# EAGLE design contact control board smd (EAGLE 6.4)
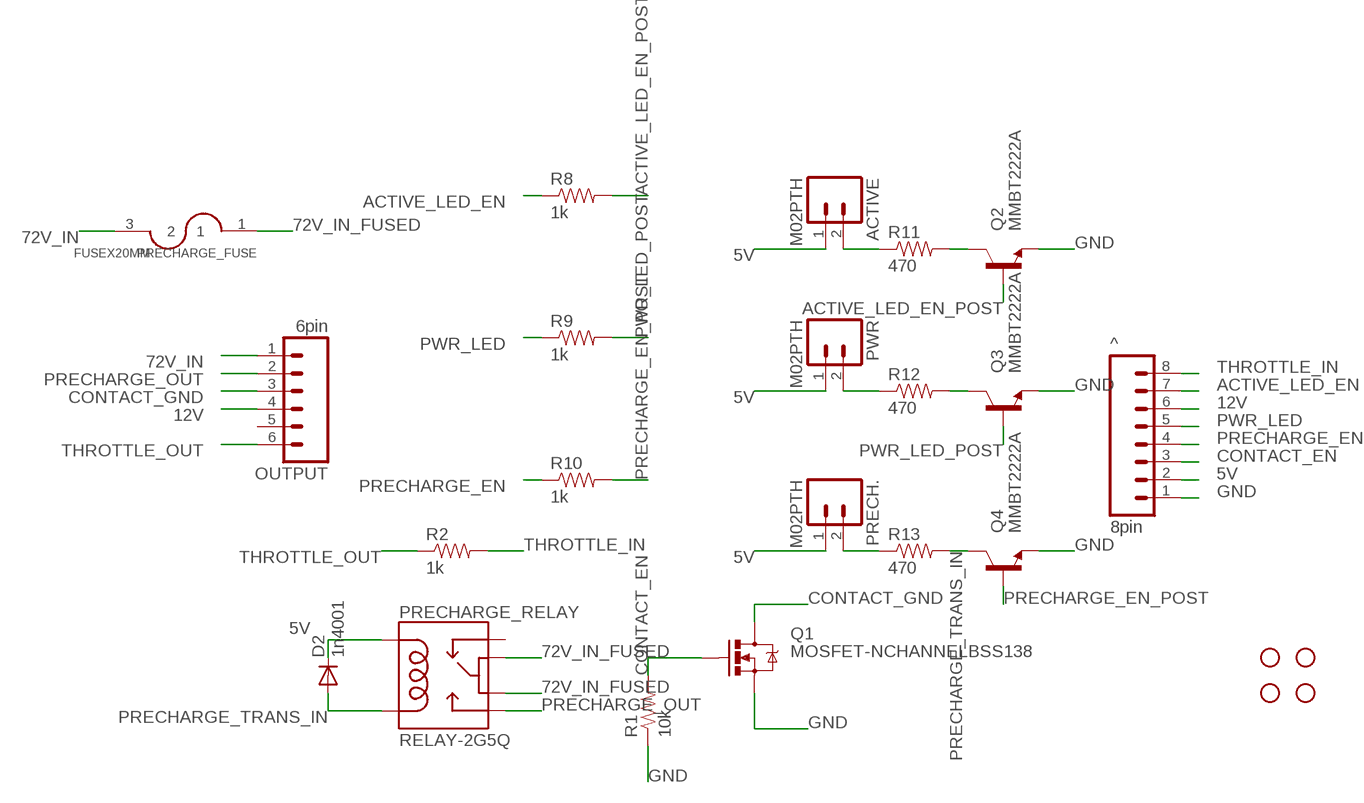
[diagram p0: schematic, sheet 1]

## Parts
^  8pin  M081X08  [1X08]
ACTIVE  M02PTH  [1X02]
D2  1n4001  DIODESMA  [SMA-DIODE]
OUTPUT  6pin  M063.5MM-6  [SCREWTERMINAL-3.5MM-6]
PRECH.  M02PTH  [1X02]
PRECHARGE_FUSE  FUSEX20MM  [FUSE_5MM]
PRECHARGE_RELAY  RELAY-2G5Q  [RELAY-G5V]
PWR  M02PTH  [1X02]
Q1  MOSFET-NCHANNELBSS138  [SOT23]
Q2  MMBT2222A  TRANSISTOR_NPNMMBT2222A  [SOT23]
Q3  MMBT2222A  TRANSISTOR_NPNMMBT2222A  [SOT23]
Q4  MMBT2222A  TRANSISTOR_NPNMMBT2222A  [SOT23]
R1  10k  RESISTOR0603  [0603-RES]
R2  1k  RESISTOR0603-RES  [0603-RES]
R8  1k  RESISTOR0603  [0603-RES]
R9  1k  RESISTOR0603  [0603-RES]
R10  1k  RESISTOR0603  [0603-RES]
R11  470  RESISTOR0603  [0603-RES]
R12  470  RESISTOR0603  [0603-RES]
R13  470  RESISTOR0603  [0603-RES]
STANDOFF1  STAND-OFF  [STAND-OFF]
STANDOFF2  STAND-OFF  [STAND-OFF]
STANDOFF3  STAND-OFF  [STAND-OFF]
STANDOFF4  STAND-OFF  [STAND-OFF]

## Nets
5V: ^.2 ACTIVE.1 D2.C PRECH..1 PRECHARGE_RELAY.2 PWR.1
12V: ^.6 OUTPUT.4
72V_IN: OUTPUT.1 PRECHARGE_FUSE.3
72V_IN_FUSED: PRECHARGE_FUSE.1 PRECHARGE_RELAY.5 PRECHARGE_RELAY.6
ACTIVE_LED_EN: ^.7 R8.1
ACTIVE_LED_EN_POST: Q2.1(B) R8.2
CONTACT_EN: ^.3 Q1.1(G) R1.2
CONTACT_GND: OUTPUT.3 Q1.3(D)
GND: ^.1 Q1.2(S) Q2.2(E) Q3.2(E) Q4.2(E) R1.1
N$4: Q2.3(C) R11.2
N$5: Q3.3(C) R12.2
N$9: ACTIVE.2 R11.1
N$12: PWR.2 R12.1
N$14: PRECH..2 R13.1
PRECHARGE_EN: ^.4 R10.1
PRECHARGE_EN_POST: Q4.1(B) R10.2
PRECHARGE_OUT: OUTPUT.2 PRECHARGE_RELAY.10
PRECHARGE_TRANS_IN: D2.A PRECHARGE_RELAY.9 Q4.3(C) R13.2
PWR_LED: ^.5 R9.1
PWR_LED_POST: Q3.1(B) R9.2
THROTTLE_IN: ^.8 R2.2
THROTTLE_OUT: OUTPUT.6 R2.1
Unconnected: OUTPUT.5 PRECHARGE_RELAY.1

## Library data of the parts
^ = SparkFun-Connectors:M08: Header 8 Standard 8-pin 0.1" header. Use with straight break away headers (SKU : PRT-00116), right angle break away headers (PRT-00553), swiss pins (PRT-00743), machine pins (PRT-00117), and female headers (PRT-00115).
ACTIVE PRECH. PWR = SparkFun-Connectors:M02: Standard 2-pin 0.1" header. Use with - straight break away headers ( PRT-00116) - right angle break away headers (PRT-00553) - swiss pins (PRT-00743) - machine pins (PRT-00117) - female headers (PRT-00115) Molex polarized connector foot print use with: PRT-08233 with associated crimp pins and housings. 2.54_SCREWTERM for use with PRT-10571. 3.5mm Screw Terminal footprints for PRT-08084 5mm Screw Terminal footprints for use with PRT-08433
D2 = SparkFun-DiscreteSemi:DIODE: Diode These are standard reverse protection diodes and small signal diodes. SMA package can handle up to about 1A. SOD-323 can handle about 200mA. What the SOD-323 package when ordering, there are some mfgs out there that are 5-pin packages.
OUTPUT = SparkFun-Connectors:M06: Header 6 Standard 6-pin 0.1" header. Use with straight break away headers (SKU : PRT-00116), right angle break away headers (PRT-00553), swiss pins (PRT-00743), machine pins (PRT-00117), and female headers (PRT-00115). Molex polarized connector foot print use with SKU : PRT-08094 with associated crimp pins and housings. NOTES ON THE VARIANTS LOCK and LOCK_LONGPADS... This footprint was designed to help hold the alignment of a through-hole component (i.e. 6-pin header) while soldering it into place. You may notice that each hole has been shifted either up or down by 0.005 of an inch from it's more standard position (which is a perfectly straight line). This slight alteration caused the pins (the squares in the middle) to touch the edges of the holes. Because they are alternating, it causes a "brace" to hold the component in place. 0.005 has proven to be the perfect amount of "off-center" position when using our standard breakaway headers. Although looks a little odd when you look at the bare footprint, once you have a header in there, the alteration is very hard to notice. Also,if you push a header all the way into place, it is covered up entirely on the bottom side. This idea of altering the position of holes to aid alignment will be further integrated into the Sparkfun Library for other footprints. It can help hold any component with 3 or more connection pins.
PRECHARGE_FUSE = SparkFun-Passives:FUSE
PRECHARGE_RELAY = SparkFun-Electromechanical:RELAY-2: SPDT relay (COM-00100)
Q1 = SparkFun-DiscreteSemi:MOSFET-NCHANNEL: Common NMOSFET Parts MFG P/N Store ID Prod ID FDD8780 TRANS-09984 SI7820DN TRANS-11055 FDS6630A IC-08089 2N7002PW TRANS-11151 FQP30N06L COM-10213 TRANS-10060 BSS123LT1G TRANS-08345 BSS138 TRANS-00830 BS170 2N7000; PROD_ID: TRANS-00830
Q2-Q4 = SparkFun-DiscreteSemi:TRANSISTOR_NPN: Generic NPN BJT MMBT2222A - TRANS-08049 (SOT-23, 1A 40V) MPSA42 - TRANS-09116 (SOT-23, 500mA 300V) MMBT5088LT1G - TRANS-11160 (SOT-23, 50 mA 30V); PROD_ID: TRANS-08049
R1 R2 R8-R13 = SparkFun-Resistors:RESISTOR: Resistor Basic schematic elements and footprints for 0603, 1206, and PTH resistors.
STANDOFF1-STANDOFF4 = SparkFun-Electromechanical:STAND-OFF: #4 Stand Off This is the mechanical footprint for a #4 phillips button head screw. Use the keepout ring to avoid running the screw head into surrounding components. SKU : PRT-00447

## Board
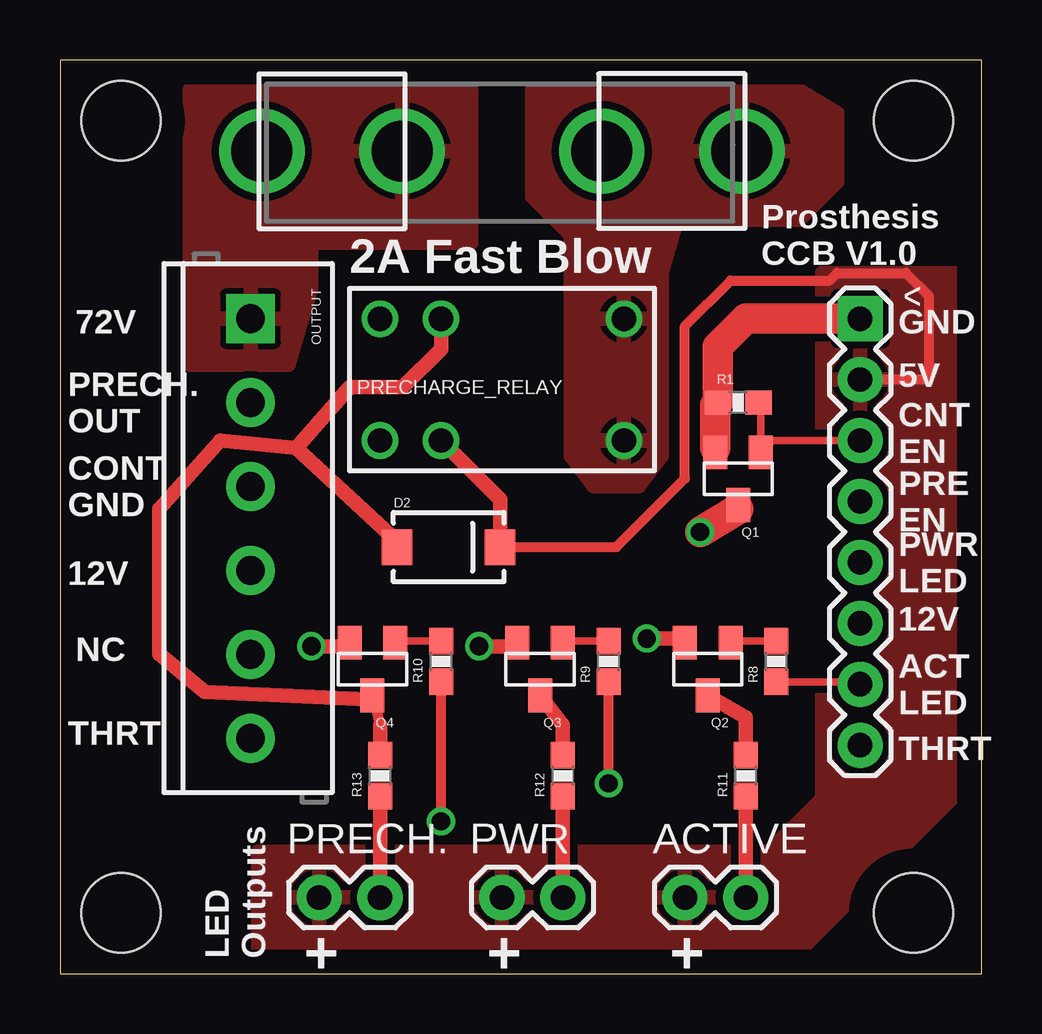
[diagram p1: board, top side]
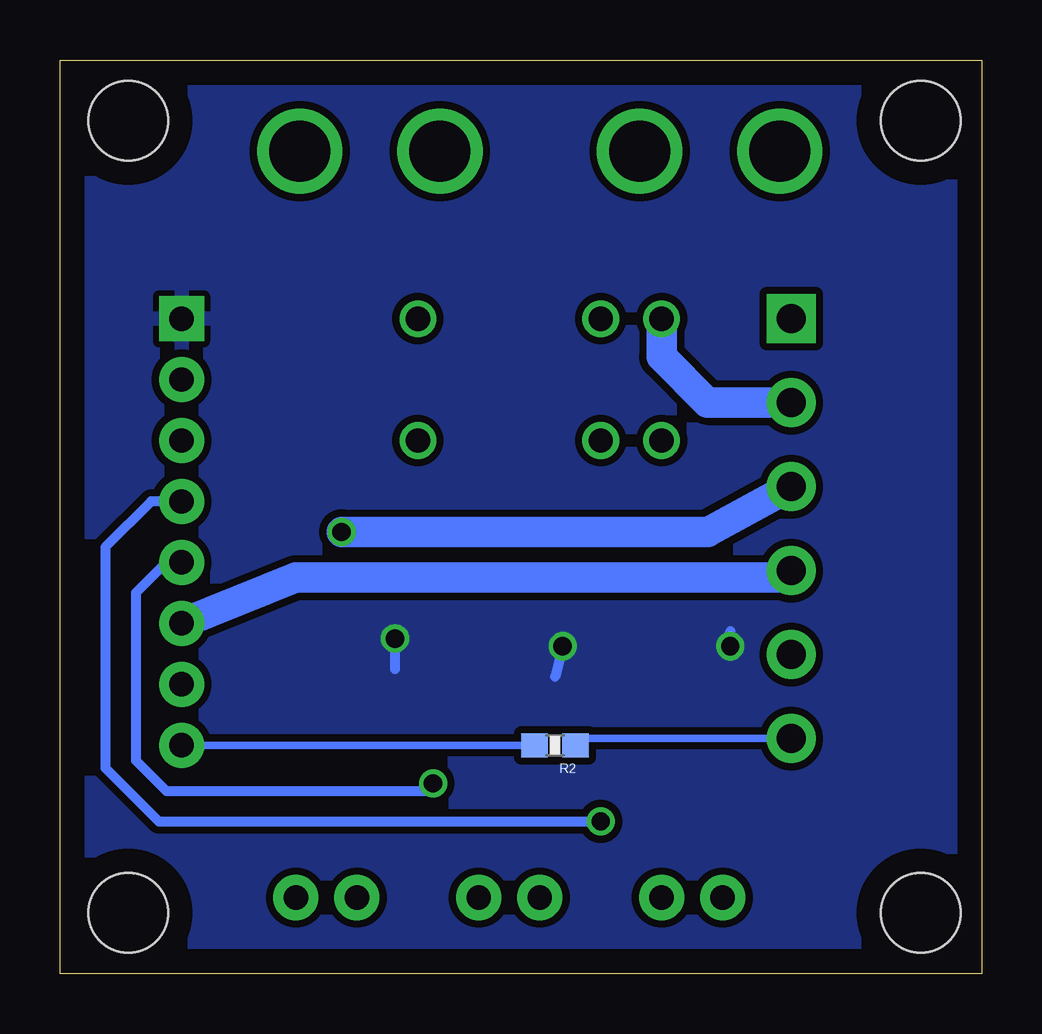
[diagram p2: board, bottom side, seen from below]

Size 38.41 x 38.09 mm. Coordinates in mm from the lower left corner, seen from the top.
Outline: 0,0 38.41,0 38.41,38.09 0,38.09 0,0
Copper layers (1*16): Top 0.035mm / dielectric 1.5mm / Bottom 0.035mm
Design rules "default *": minimum track width 10mil, minimum drill 24mil, track to track 12mil, track to pad 12mil, pad to pad 12mil, via to via 12mil, smd to smd 8mil, copper to edge 40mil, drill to drill 8mil, minimum pad ring 10mil, minimum via ring 8mil, stop-mask expansion 4mil, vias tented up to drill 0mil, thermal gap 10mil

### Footprints (pad centres in the part's own frame; a part is rotated, then mirrored left to right if it is on the bottom)
1X08 = drill 1.016 pad 1.88 square: 1 0,0 | drill 1.016 pad 1.88: 2 2.54,0; 3 5.08,0; 4 7.62,0; 5 10.16,0; 6 12.7,0; 7 15.24,0; 8 17.78,0
1X02 = drill 1.016 pad 1.88: 1 0,0; 2 2.54,0
SMA-DIODE = smd 1.27 x 1.47: A -2.15,0; C 2.15,0
SCREWTERMINAL-3.5MM-6 = drill 1.2 pad 2.032 square: 1 0,0 | drill 1.2 pad 2.032: 2 3.5,0; 3 7,0; 4 10.5,0; 5 14,0; 6 17.5,0
FUSE_5MM = drill 2.54 pad 3.556: 1 0,-10; 2 0,-4.158; 3 0,4.158; 4 0,10
RELAY-G5V = drill 1.016: 1 5.08,2.54; 2 2.54,2.54; 5 -5.08,2.54; 6 -5.08,-2.54; 9 2.54,-2.54; 10 5.08,-2.54
SOT23 = smd 1 x 1.4: 1 -0.95,-1.1; 2 0.95,-1.1; 3 0,1.1
0603-RES = smd 1.1 x 1: 1 -0.85,0; 2 0.85,0
STAND-OFF = hole 3.302: 0,0

### Placement (x,y rotation side)
^  33.34,27.3 270 top
ACTIVE  26.04,3.17 0 top
D2  16.19,17.78 0 top
OUTPUT  7.94,27.3 270 top
PRECH.  10.79,3.17 0 top
PRECHARGE_FUSE  18.41,34.29 90 top
PRECHARGE_RELAY  18.41,24.77 180 top
PWR  18.41,3.17 0 top
Q1  28.26,20.64 180 top
Q2  26.99,12.7 180 top
Q3  20,12.7 180 top
Q4  13.02,12.7 180 top
R1  28.26,23.81 0 top
R2  17.78,9.53 180 bottom
R8  29.84,13.02 90 top
R9  22.86,13.02 90 top
R10  15.88,13.02 90 top
R11  28.57,8.26 90 top
R12  20.95,8.26 90 top
R13  13.34,8.26 90 top
STANDOFF1  2.54,2.54 0 top
STANDOFF2  2.54,35.56 0 top
STANDOFF3  35.56,35.56 0 top
STANDOFF4  35.56,2.54 0 top

### Tracks (layer width: path | path; a pad name or v marks a point on that pad's centre or on a via)
5V
  Top 0.406: D2.C 23.18,17.78 26.04,20.64 26.04,26.99 27.94,28.89 32.07,28.89 32.38,29.21 35.24,29.21 36.2,28.26 36.2,24.77 ^.2
  Top 0.61: PRECHARGE_RELAY.2 18.34,19.76 D2.C
  pour Top: 31.75,29.21 31.75,7.3 29.53,5.08 8.26,5.08 8.26,1.27 7.94,0.95 30.8,0.95 31.11,1.27 37.47,7.62 37.47,29.21
12V
  Bottom 1.27: ^.6 28.57,16.51 8.23,16.51 OUTPUT.4
72V_IN
  pour Top: 17.14,36.83 17.14,30.48 10.48,30.48 10.48,28.57 9.53,25.4 5.4,25.4 5.4,36.83
72V_IN_FUSED
  pour Top: 19.68,36.83 19.68,32.38 21.27,30.8 21.27,21.59 22.23,20.32 24.13,20.32 25.08,21.59 25.08,29.21 25.72,31.43 30.8,31.43 32.38,33.02 32.38,35.88 30.8,36.83
ACTIVE_LED_EN
  Top 0.305: R8.1 33.23,12.17 ^.7
ACTIVE_LED_EN_POST
  Top 0.305: R8.2 28,13.87 Q2.1
CONTACT_EN
  Top 0.305: ^.3 29.7,22.23 Q1.1 29.21,23.71 R1.2
CONTACT_GND  (via drill 0.76)
  Top 0.61: Q1.3 28.26,19.37
  Top 1.27: 28.26,19.37 v26.67,18.41
  Bottom 1.27: v26.67,18.41 11.41,18.41 OUTPUT.3
GND  (via drill 0.76)
  Top 0.305: Q1.2 27.31,21.91 27.3,21.91 | 27.3,23.71 R1.1
  Top 0.406: Q4.2 11.92,13.65 | Q3.2 18.91,13.65 | Q2.2 25.87,13.97
  Top 0.61: 11.92,13.65 v10.48,13.65 | 18.91,13.65 v17.46,13.65 | 25.87,13.97 v24.45,13.97
  Top 1.27: R1.1 27.41,26.14 28.57,27.3 ^.1 | 27.3,21.91 27.3,23.71
  Bottom 0.406: v10.48,13.65 10.48,14.29 | v17.46,13.65 17.78,12.38 | v24.45,13.97 24.45,12.7
  pour Bottom: 0.64,37.47 0.64,0.64 37.47,0.64 37.47,37.47
N$4
  Top 0.61: Q2.3 28.57,10.69 R11.2
N$5
  Top 0.61: Q3.3 20.95,10.38 R12.2
N$9
  Top 0.61: R11.1 ACTIVE.2
N$12
  Top 0.61: R12.1 PWR.2
N$14
  Top 0.61: R13.1 PRECH..2
PRECHARGE_EN  (via drill 0.76)
  Top 0.406: v15.88,6.35 R10.1
  Bottom 0.406: ^.4 34.61,19.68 36.51,17.78 36.51,8.57 34.29,6.35 v15.88,6.35
PRECHARGE_EN_POST
  Top 0.305: R10.2 14.04,13.87 Q4.1
PRECHARGE_OUT
  Bottom 1.27: PRECHARGE_RELAY.10 13.34,25.72 11.43,23.81 7.95,23.81 OUTPUT.2
PRECHARGE_TRANS_IN
  Top 0.305: 12.85,11.43 Q4.3 | D2.A 14.04,18.02
  Top 0.406: Q4.3 13.34,10.38
  Top 0.61: 13.34,10.38 R13.2 | PRECHARGE_RELAY.9 15.88,26.04 14.29,24.45 12.06,24.45 9.84,21.91 | 9.84,21.91 6.67,22.23 4.13,19.37 4.13,13.34 6.03,11.75 12.85,11.43 | 14.04,18.02 9.84,21.91
PWR_LED  (via drill 0.76)
  Top 0.406: v22.86,7.94 R9.1
  Bottom 0.406: ^.5 33.97,17.14 35.24,15.88 35.24,8.89 33.97,7.62 23.18,7.62 v22.86,7.94
PWR_LED_POST
  Top 0.305: R9.2 21.02,13.87 Q3.1
THROTTLE_IN
  Bottom 0.305: R2.2 ^.8
THROTTLE_OUT
  Bottom 0.305: OUTPUT.6 16.65,9.8 R2.1

### Text on the board
tNames: Prosthesis / CCB V1.0 | 2A Fast Blow | 72V | GND | 5V | PRECH. / OUT | CNT / EN | CONT / GND | PRE / EN | 12V | PWR / LED | 12V | NC | ACT / LED | THRT | THRT | LED / Outputs | + | + | +